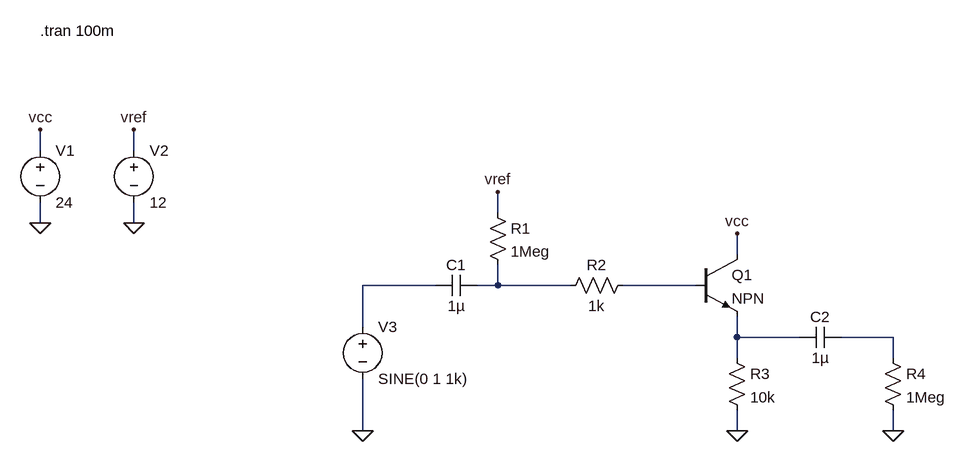
[diagram p0: schematic buffer.asc]
buffer.asc, the LTspice schematic file:
Version 4
SHEET 1 880 680
WIRE -832 -32 -832 -64
WIRE -688 -32 -688 -64
WIRE -128 64 -128 32
WIRE -832 80 -832 48
WIRE -688 80 -688 48
WIRE 240 128 240 96
WIRE -224 176 -336 176
WIRE -128 176 -128 144
WIRE -128 176 -160 176
WIRE -16 176 -128 176
WIRE 176 176 64 176
WIRE -336 240 -336 176
WIRE 240 256 240 224
WIRE 336 256 240 256
WIRE 480 256 400 256
WIRE 240 288 240 256
WIRE 480 288 480 256
WIRE -336 400 -336 320
WIRE 240 400 240 368
WIRE 480 400 480 368
FLAG -832 80 0
FLAG -688 80 0
FLAG 240 400 0
FLAG 480 400 0
FLAG -832 -64 vcc
FLAG -688 -64 vref
FLAG -128 32 vref
FLAG 240 96 vcc
FLAG -336 400 0
SYMBOL cap -160 160 R90
WINDOW 0 0 32 VBottom 2
WINDOW 3 32 32 VTop 2
SYMATTR InstName C1
SYMATTR Value 1µ
SYMBOL res -144 48 R0
SYMATTR InstName R1
SYMATTR Value 1Meg
SYMBOL res 80 160 R90
WINDOW 0 0 56 VBottom 2
WINDOW 3 32 56 VTop 2
SYMATTR InstName R2
SYMATTR Value 1k
SYMBOL res 224 272 R0
SYMATTR InstName R3
SYMATTR Value 10k
SYMBOL res 464 272 R0
SYMATTR InstName R4
SYMATTR Value 1Meg
SYMBOL cap 400 240 R90
WINDOW 0 0 32 VBottom 2
WINDOW 3 32 32 VTop 2
SYMATTR InstName C2
SYMATTR Value 1µ
SYMBOL voltage -832 -48 R0
SYMATTR InstName V1
SYMATTR Value 24
SYMBOL voltage -688 -48 R0
SYMATTR InstName V2
SYMATTR Value 12
SYMBOL voltage -336 224 R0
WINDOW 123 0 0 Left 2
WINDOW 39 0 0 Left 2
SYMATTR InstName V3
SYMATTR Value SINE(0 1 1k)
SYMBOL npn 176 128 R0
SYMATTR InstName Q1
TEXT -832 -216 Left 2 !.tran 100m

The netlist it stands for:
* buffer.asc
C1 N002 N001 1µ
R1 vref N002 1Meg
R2 N003 N002 1k
R3 N004 0 10k
R4 N005 0 1Meg
C2 N005 N004 1µ
V1 vcc 0 24
V2 vref 0 12
V3 N001 0 SINE(0 1 1k)
Q1 vcc N003 N004 0 NPN
.model NPN NPN
.model PNP PNP
.lib standard.bjt
.tran 100m
.backanno
.end